# EAGLE design Schematic (EAGLE 6.5.0)
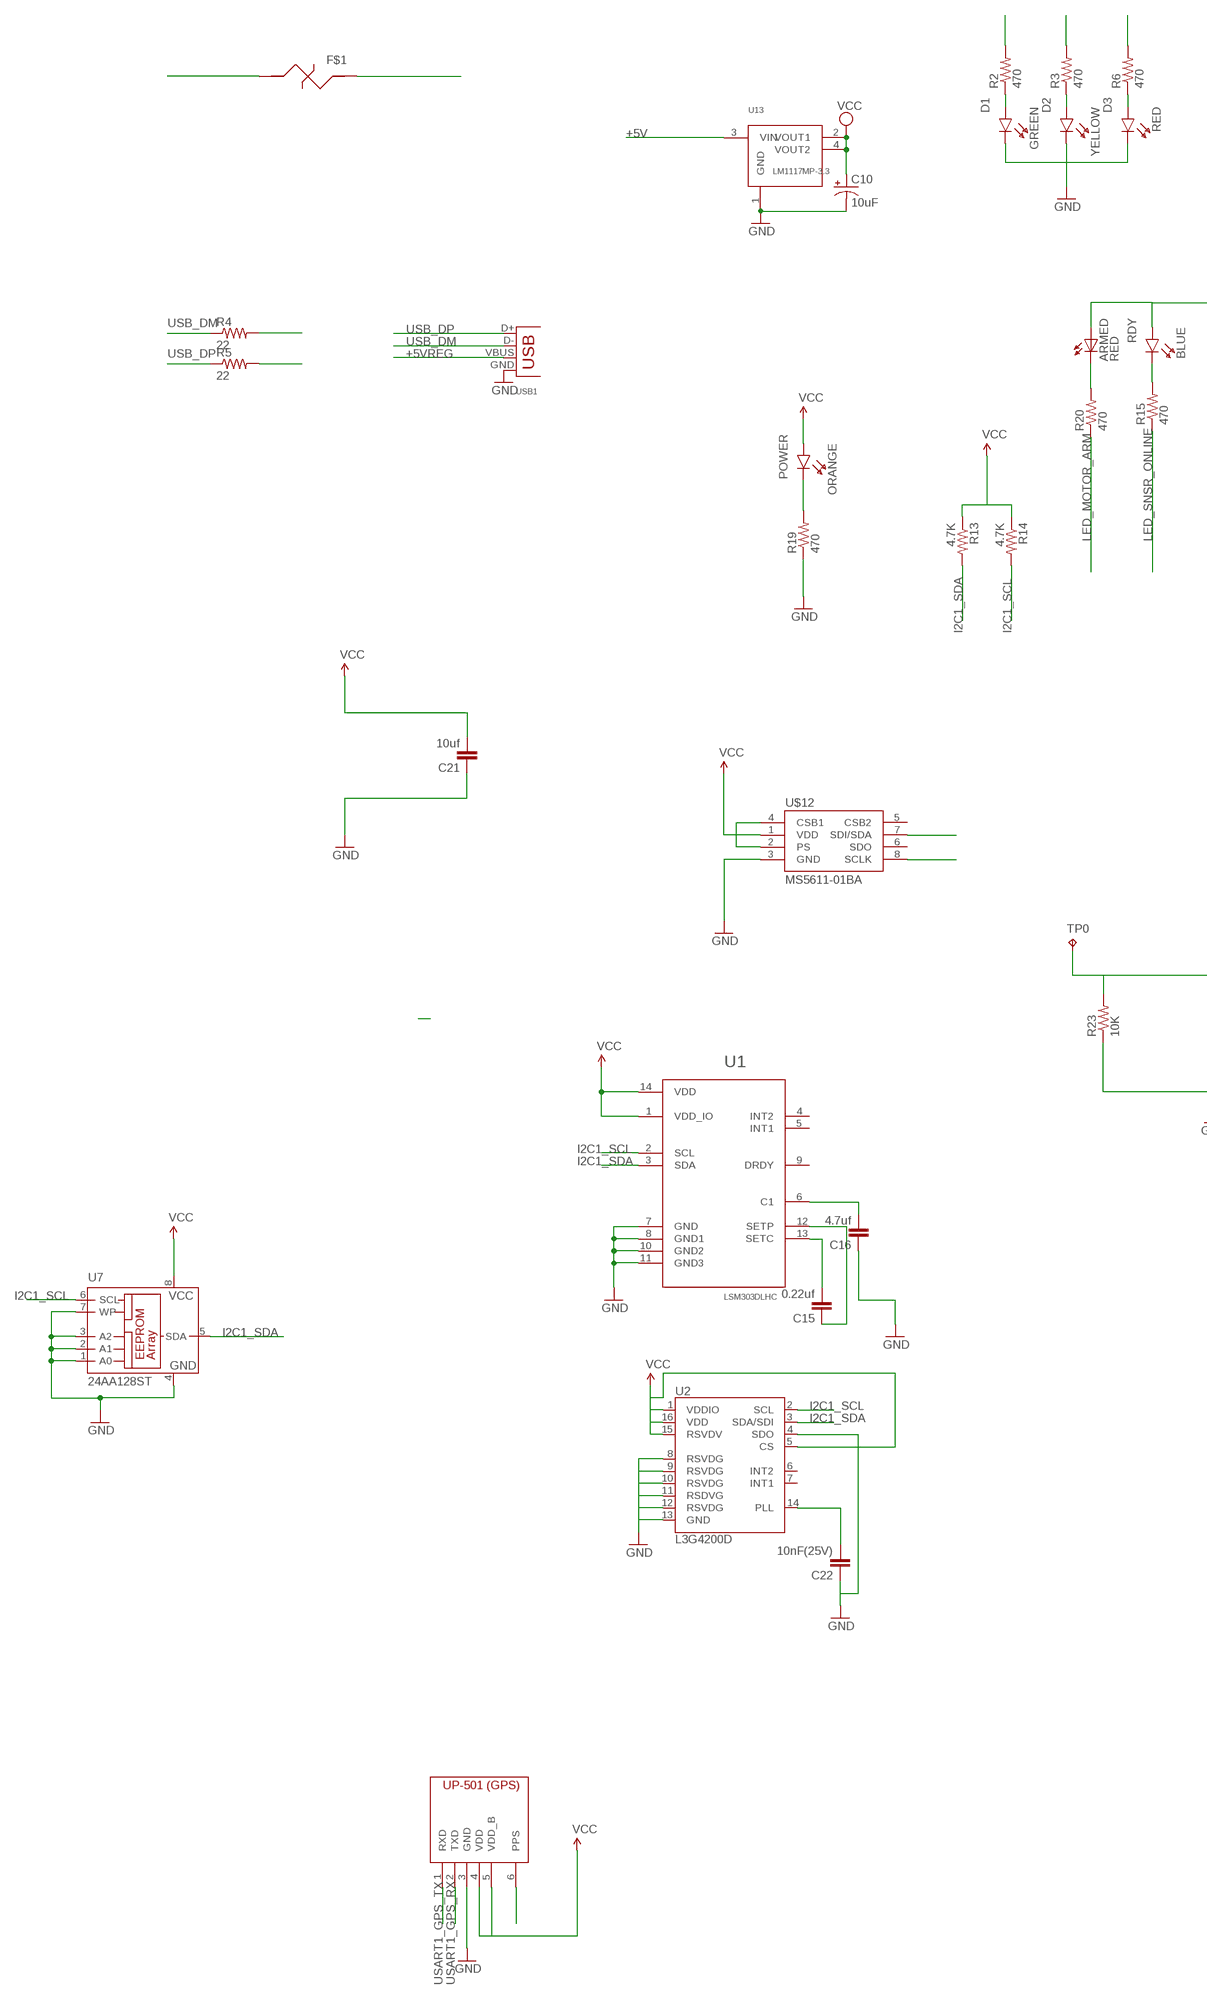
[diagram p0: schematic, sheet 1, part 1 of 2]
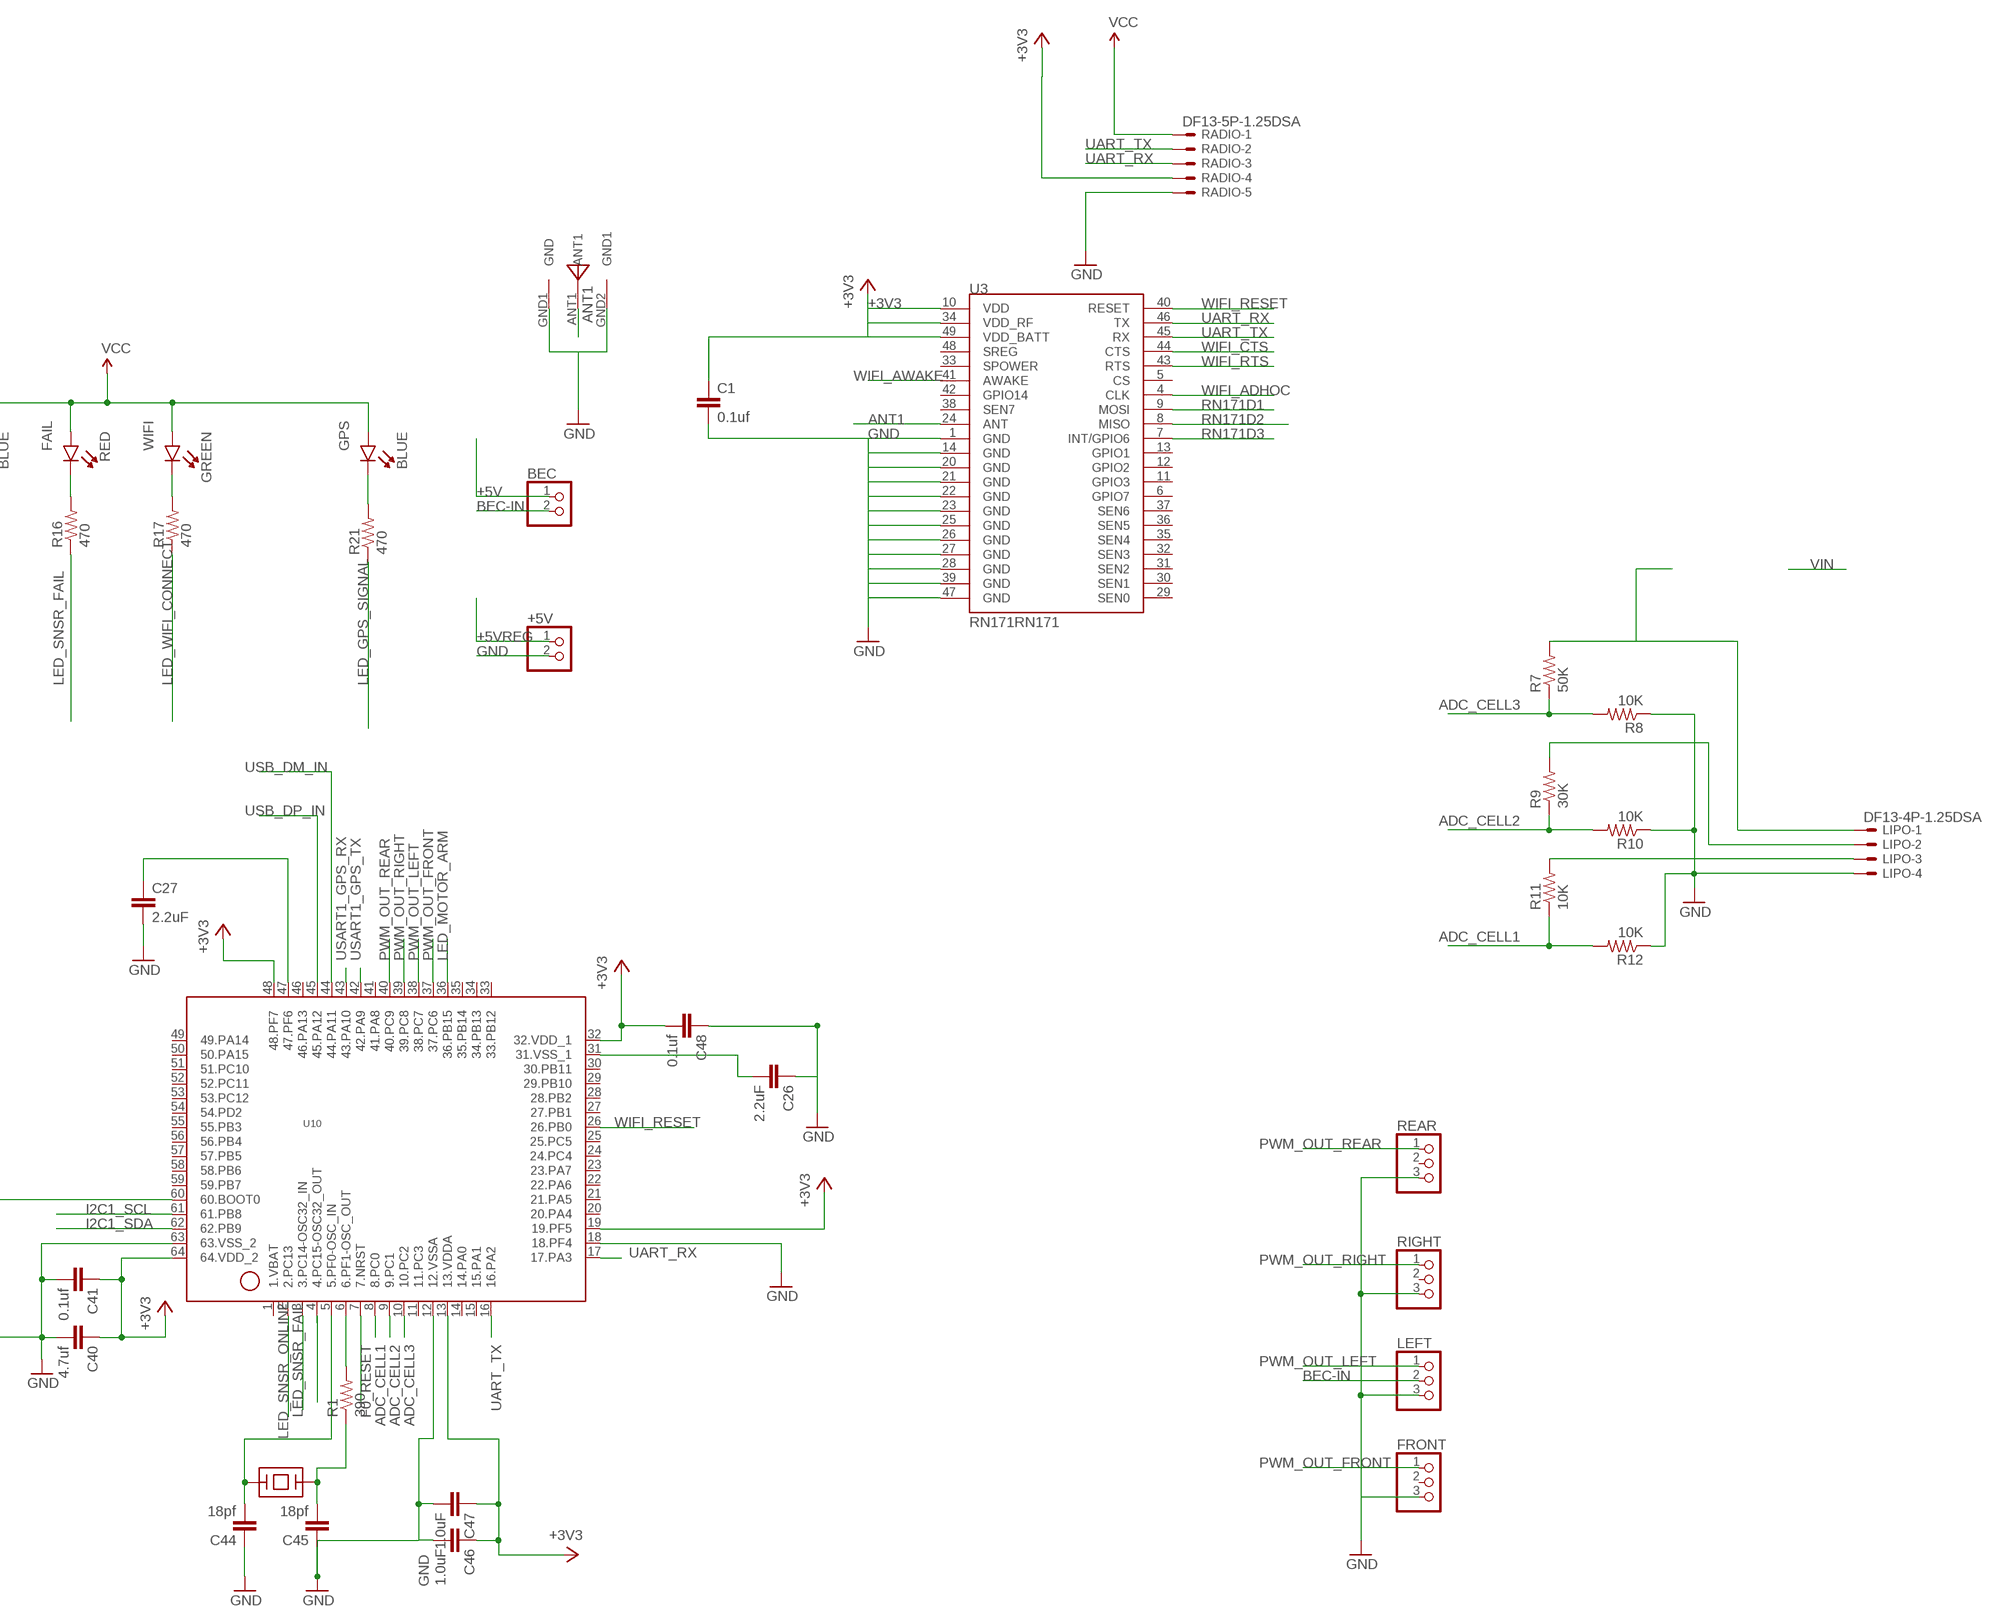
[diagram p1: schematic, sheet 1, part 2 of 2]

## Parts
+5V  PINHD-1X2  [1X02]
ARMED  RED  LED-REDLILYPAD  [LED-1206]
BEC  PINHD-1X2  [1X02]
C1  0.1uf  CAP0805  [0805]
C10  10uF  CPOL-USCT3528  [CT3528]
C15  0.22uf  CAP0805  [0805]
C16  4.7uf  CAP0805  [0805]
C21  10uf  CAP0805  [0805]
C22  10nF(25V)  CAP0805  [0805]
C26  2.2uF  CAP0805  [0805]
C27  2.2uF  CAP0805  [0805]
C40  4.7uf  CAP0805  [0805]
C41  0.1uf  CAP0805  [0805]
C44  18pf  CAP0805  [0805]
C45  18pf  CAP0805  [0805]
C46  1.0uF  CAP0805  [0805]
C47  1.0uF  CAP0805  [0805]
C48  0.1uf  CAP0805  [0805]
D1  GREEN  SMD_LED0805  [LED0805]
D2  YELLOW  SMD_LED0805  [LED0805]
D3  RED  SMD_LED0805  [LED0805]
F1  1206L050_FUSE  [1206L050_FUSE]
FAIL  RED  SMD_LED0805  [LED0805]
FRONT  PINHD-1X3  [1X03]
GPS  BLUE  SMD_LED0805  [LED0805]
LEFT  PINHD-1X3  [1X03]
LIPO  DF13-4P-1.25DSA  [DF13-4P-1.25DSA]
POWER  ORANGE  SMD_LED0805  [LED0805]
R1  390  RESISTOR0805-RES  [0805]
R2  470  RESISTOR0805-RES  [0805]
R3  470  RESISTOR0805-RES  [0805]
R4  22  RESISTOR0805-RES  [0805]
R5  22  RESISTOR0805-RES  [0805]
R6  470  RESISTOR0805-RES  [0805]
R7  50K  RESISTOR0805-RES  [0805]
R8  10K  RESISTOR0805-RES  [0805]
R9  30K  RESISTOR0805-RES  [0805]
R10  10K  RESISTOR0805-RES  [0805]
R11  10K  RESISTOR0805-RES  [0805]
R12  10K  RESISTOR0805-RES  [0805]
R13  4.7K  RESISTOR0805-RES  [0805]
R14  4.7K  RESISTOR0805-RES  [0805]
R15  470  RESISTOR0805-RES  [0805]
R16  470  RESISTOR0805-RES  [0805]
R17  470  RESISTOR0805-RES  [0805]
R19  470  RESISTOR0805-RES  [0805]
R20  470  RESISTOR0805-RES  [0805]
R21  470  RESISTOR0805-RES  [0805]
R23  10K  RESISTOR0805-RES  [0805]
RADIO  DF13-5P-1.25DSA  [DF13-5P-1.25DSA]
RDY  BLUE  SMD_LED0805  [LED0805]
REAR  PINHD-1X3  [1X03]
RIGHT  PINHD-1X3  [1X03]
TP0  TPTP15R  [TP15R]
U1  LSM303DLHC  [LGA3X5X1-14L]
U2  L3G4200D  [LGA16-4X4]
U3  RN171RN171  [RN171]
U7  24AA128ST  [TSSOP8]
U10  STM32F051XXX  [STM32F051XXX_LPFP64]
U13  LM1117MP-3.3  LM1117  [SOT223]
U$1  U.FLCONNECTOR  [U.FLCONNECTOR]
U$4  UP501  [UP-501]
U$12  MS5611-01BA  [MS5611-01BA]
USB1  DX2R005HN2E700  USB-MB-S  [USB-MB-S]
WIFI  GREEN  SMD_LED0805  [LED0805]
X2  ABRACON_ABM7  [ABRACON_ABM7_CERAMIC_XTAL]

## Nets
+3V3: ARMED.A C1.1 C10.+ C21.2 C40.1 C41.1 C46.1 C47.1 C48.2 FAIL.P$1(A) GPS.P$1(A) POWER.P$1(A) R13.1 R14.1 RADIO.4 RDY.P$1(A) U1.1(VDD_IO) U1.14(VDD) U2.1(VDDIO) U2.5(CS) U2.15(RSVDV) U2.16(VDD) U3.10(VDD) U3.34(VDD_RF) U3.49(VDD_BATT) U7.8(VCC) U10.13(13.VDDA) U10.19(19.PF5) U10.32(32.VDD_1) U10.48(48.PF7) U10.64(64.VDD_2) U13.2(VOUT1) U13.4(VOUT2) U$4.4(VDD) U$4.5(VDD_B) U$12.1(VDD) U$12.2(PS) U$12.4(CSB1) WIFI.P$1(A) ; supply symbol labelled VCC
+5V: BEC.1 F1.P$2 RADIO.1 U13.3(VIN) ; supply symbol labelled VCC
+5VREG: +5V.1 F1.P$1 USB1.VBUS
ADC_CELL1: R11.1 R12.2 U10.8(8.PC0)
ADC_CELL2: R9.1 R10.2 U10.9(9.PC1)
ADC_CELL3: R7.1 R8.2 U10.10(10.PC2)
ANT1: U3.24(ANT) U$1.ANT1
BEC-IN: BEC.2 LEFT.2
F0_RESET: U10.7(7.NRST)
GND [power]: +5V.2 C1.2 C10.- C16.1 C21.1 C22.1 C26.1 C27.2 C40.2 C41.2 C44.1 C45.1 C46.2 C47.2 C48.1 D1.C D2.C D3.C FRONT.3 LEFT.3 LIPO.4 R8.1 R10.1 R12.1 R19.1 R23.1 RADIO.5 REAR.3 RIGHT.3 U1.7(GND) U1.8(GND1) U1.10(GND2) U1.11(GND3) U2.4(SDO) U2.8(RSVDG) U2.9(RSVDG) U2.10(RSVDG) U2.11(RSDVG) U2.12(RSVDG) U2.13(GND) U3.1(GND) U3.14(GND) U3.20(GND) U3.21(GND) U3.22(GND) U3.23(GND) U3.25(GND) U3.26(GND) U3.27(GND) U3.28(GND) U3.39(GND) U3.47(GND) U7.1(A0) U7.2(A1) U7.3(A2) U7.4(GND) U7.7(WP) U10.12(12.VSSA) U10.18(18.PF4) U10.63(63.VSS_2) U13.1(GND) U$1.GND1(GND) U$1.GND2(GND1) U$4.3(GND) U$12.3(GND) USB1.GND
I2C1_SCL: R14.2 U1.2(SCL) U2.2(SCL) U7.6(SCL) U10.61(61.PB8) U$12.8(SCLK)
I2C1_SDA: R13.2 U1.3(SDA) U2.3(SDA/SDI) U7.5(SDA) U10.62(62.PB9) U$12.7(SDI/SDA)
LED_GPS_SIGNAL: R21.1 U$4.6(PPS)
LED_MOTOR_ARM: R20.1 U10.36(36.PB15)
LED_SNSR_FAIL: R16.1 U10.3(3.PC14-OSC32_IN)
LED_SNSR_ONLINE: R15.1 U10.2(2.PC13)
LED_WIFI_CONNECT: R17.1 U10.4(4.PC15-OSC32_OUT)
N$1: D1.P$1(A) R2.1
N$4: D2.P$1(A) R3.1
N$5: R1.2 U10.6(6.PF1-OSC_OUT)
N$6: D3.P$1(A) R6.1
N$8: C16.2 U1.6(C1)
N$9: R15.2 RDY.C
N$12: C15.1 U1.12(SETP)
N$13: C15.2 U1.13(SETC)
N$14: FAIL.C R16.2
N$15: ARMED.C R20.2
N$16: LIPO.3 R11.2
N$17: LIPO.2 R9.2
N$19: R17.2 WIFI.C
N$21: POWER.C R19.2
N$25: R23.2 TP0.TP U10.60(60.BOOT0)
N$27: C22.2 U2.14(PLL)
N$30: GPS.C R21.2
N$31: C26.2 U10.31(31.VSS_1)
N$32: C27.1 U10.47(47.PF6)
OSC_IN: C44.2 U10.5(5.PF0-OSC_IN) X2.P$1
OSC_OUT: C45.2 R1.1 X2.P$2
PWM_OUT_FRONT: FRONT.1 U10.37(37.PC6)
PWM_OUT_LEFT: LEFT.1 U10.38(38.PC7)
PWM_OUT_REAR: REAR.1 U10.40(40.PC9)
PWM_OUT_RIGHT: RIGHT.1 U10.39(39.PC8)
RN171D1: R2.2 U3.9(MOSI)
RN171D2: R3.2 U3.8(MISO)
RN171D3: R6.2 U3.7(INT/GPIO6)
UART_RX: RADIO.3 U3.46(TX) U10.17(17.PA3)
UART_TX: RADIO.2 U3.45(RX) U10.16(16.PA2)
USART1_GPS_RX: U10.43(43.PA10) U$4.2(TXD)
USART1_GPS_TX: U10.42(42.PA9) U$4.1(RXD)
USB_DM: R4.1 USB1.D-
USB_DM_IN: R4.2 U10.44(44.PA11)
USB_DP: R5.1 USB1.D+
USB_DP_IN: R5.2 U10.45(45.PA12)
VIN_PROTECTED: LIPO.1 R7.2
WIFI_ADHOC: U3.4(CLK)
WIFI_AWAKE: U3.41(AWAKE)
WIFI_CTS: U3.44(CTS)
WIFI_RESET: U3.40(RESET) U10.26(26.PB0)
WIFI_RTS: U3.43(RTS)
Unconnected: FRONT.2 REAR.2 RIGHT.2 U1.4(INT2) U1.5(INT1) U1.9(DRDY) U2.6(INT2) U2.7(INT1) U3.5(CS) U3.6(GPIO7) U3.11(GPIO3) U3.12(GPIO2) U3.13(GPIO1) U3.29(SEN0) U3.30(SEN1) U3.31(SEN2) U3.32(SEN3) U3.33(SPOWER) U3.35(SEN4) U3.36(SEN5) U3.37(SEN6) U3.38(SEN7) U3.42(GPIO14) U3.48(SREG) U10.1(1.VBAT) U10.11(11.PC3) U10.14(14.PA0) U10.15(15.PA1) U10.20(20.PA4) U10.21(21.PA5) U10.22(22.PA6) U10.23(23.PA7) U10.24(24.PC4) U10.25(25.PC5) U10.27(27.PB1) U10.28(28.PB2) U10.29(29.PB10) U10.30(30.PB11) U10.33(33.PB12) U10.34(34.PB13) U10.35(35.PB14) U10.41(41.PA8) U10.46(46.PA13) U10.49(49.PA14) U10.50(50.PA15) U10.51(51.PC10) U10.52(52.PC11) U10.53(53.PC12) U10.54(54.PD2) U10.55(55.PB3) U10.56(56.PB4) U10.57(57.PB5) U10.58(58.PB6) U10.59(59.PB7) U$12.5(CSB2) U$12.6(SDO)

## Library data of the parts
+5V BEC = pinhead:PINHD-1X2: PIN HEADER
ARMED = SparkFun-LED:LED-RED: Assorted Red LEDs LilyPad 1206- DIO-09912 1206- DIO-00809 0603- DIO-00819; PROD_ID: DIO-09912
C1 C26 C27 C40 C41 C44-C48 = SparkFun-Passives:CAP: Capacitor Standard 0603 ceramic capacitor, and 0.1" leaded capacitor.
C10 = rcl:CPOL-US: POLARIZED CAPACITOR, American symbol
C15 C16 C21 C22 = SparkFun:CAP: Capacitor Standard 0603 ceramic capacitor, and 0.1" leaded capacitor.
D1-D3 FAIL GPS POWER RDY WIFI = SoftwareLogisticsParts:SMD_LED0805
F1 = SoftwareLogisticsParts:1206L050_FUSE
FRONT LEFT REAR RIGHT = pinhead:PINHD-1X3: PIN HEADER
LIPO = pixhawk2:DF13-4P-1.25?
R1-R17 R19-R21 R23 = SparkFun-Passives:RESISTOR: Resistor Basic schematic elements and footprints for 0603, 1206, and PTH resistors.
RADIO = pixhawk2:DF13-5P-1.25?
TP0 = testpad:TP: Test pad
U1 = SoftwareLogisticsParts (2):LSM303DLHC: 3D Accelerometer and 3D Magenetometer Module ST Micro Electronics
U2 = SparkFun:L3G4200D: L3G4200D Three-axis, digital output gyroscope The L3G4200D is a low-power three-axis angular rate sensor, has a full scale of ±250/±500/±2000 dps and is capable of measuring rates with a user-selectable bandwidth. It includes a sensing element and an IC interface capable of providing the measured angular rate to the external world through a digital interface (I2C/SPI). Package: 4x4x1.1 LGA-16 (LGA16-4x4.PAC)
U3 = SparkFun-RF:RN171: WiFi Module
U7 = microchip:24*: Serial EEPROM I2C; MF: MICROCHIP; MPN: 24AA128-I/ST; OC_FARNELL: unknown; OC_NEWARK: 92C6843
U10 = Nwazet.Go:STM32F051XXX
U13 = GHI:LM1117
U$1 = SoftwareLogisticsParts:U.FLCONNECTOR
U$4 = SoftwareLogisticsParts (2):UP501
U$12 = 3DRobotics:MS5611-01BA: MS5611-01BA The MS5611-01BA is a new generation of high resolution altimeter sensors from MEAS Switzerland with SPI and I 2 C bus interface. It is optimized for altimeters and variometers with an altitude resolution of 10 cm. The sensor module includes a high linearity pressure sensor and an ultra low power 24 bit ?? ADC with internal factory calibrated coefficients. It provides a precise digital 24 Bit pressure and temperature value and different operation modes that allow the user to optimize for conversion speed and current consumption. A high resolution temperature output allows the implementation of an altimeter/thermometer function without any additional sensor. The MS5611-01BA can be interfaced to virtually any microcontroller. The communication protocol is simple, without the need of programming internal registers in the device. Small dimensions of only 5.0 mm x 3.0 mm and a height of 1.7 mm allow for integration in mobile devices. This new sensor module generation is based on leading MEMS technology and latest benefits from MEAS Switzerland proven experience and know-how in high volume manufacturing of altimeter modules, which have been widely used for over a decade. The sensing principle employed leads to very low hysteresis and high stability of both pressure and temperature signal. High resolution module, 10 cm Fast conversion down to 1 ms Low power, 1 µA (standby < 0.15 µA) QFN package 5.0 x 3.0 x 1.7 mm3 Supply voltage 1.8 to 3.6 V Integrated digital pressure sensor (24 bit ?? ADC) Operating range: 10 to 1200 mbar, -40 to +85 °C I2C and SPI interface up to 20 MHz No external components (Internal oscillator) Excellent long term stability; DATASHEET: http://www.meas-spec.com/downloads/MS5611-01BA01.pdf; LINK: http://www.meas-spec.com/product/t_product.aspx?id=8503#; MFGPN: MS5611-01BA
USB1 = con-usb-3:USB: USB Connectors
X2 = Nwazet.Go:ABRACON_ABM7

## Net classes
0 default: width 0.178 mm, drill 0.381 mm, clearance 0.178 mm

## Board
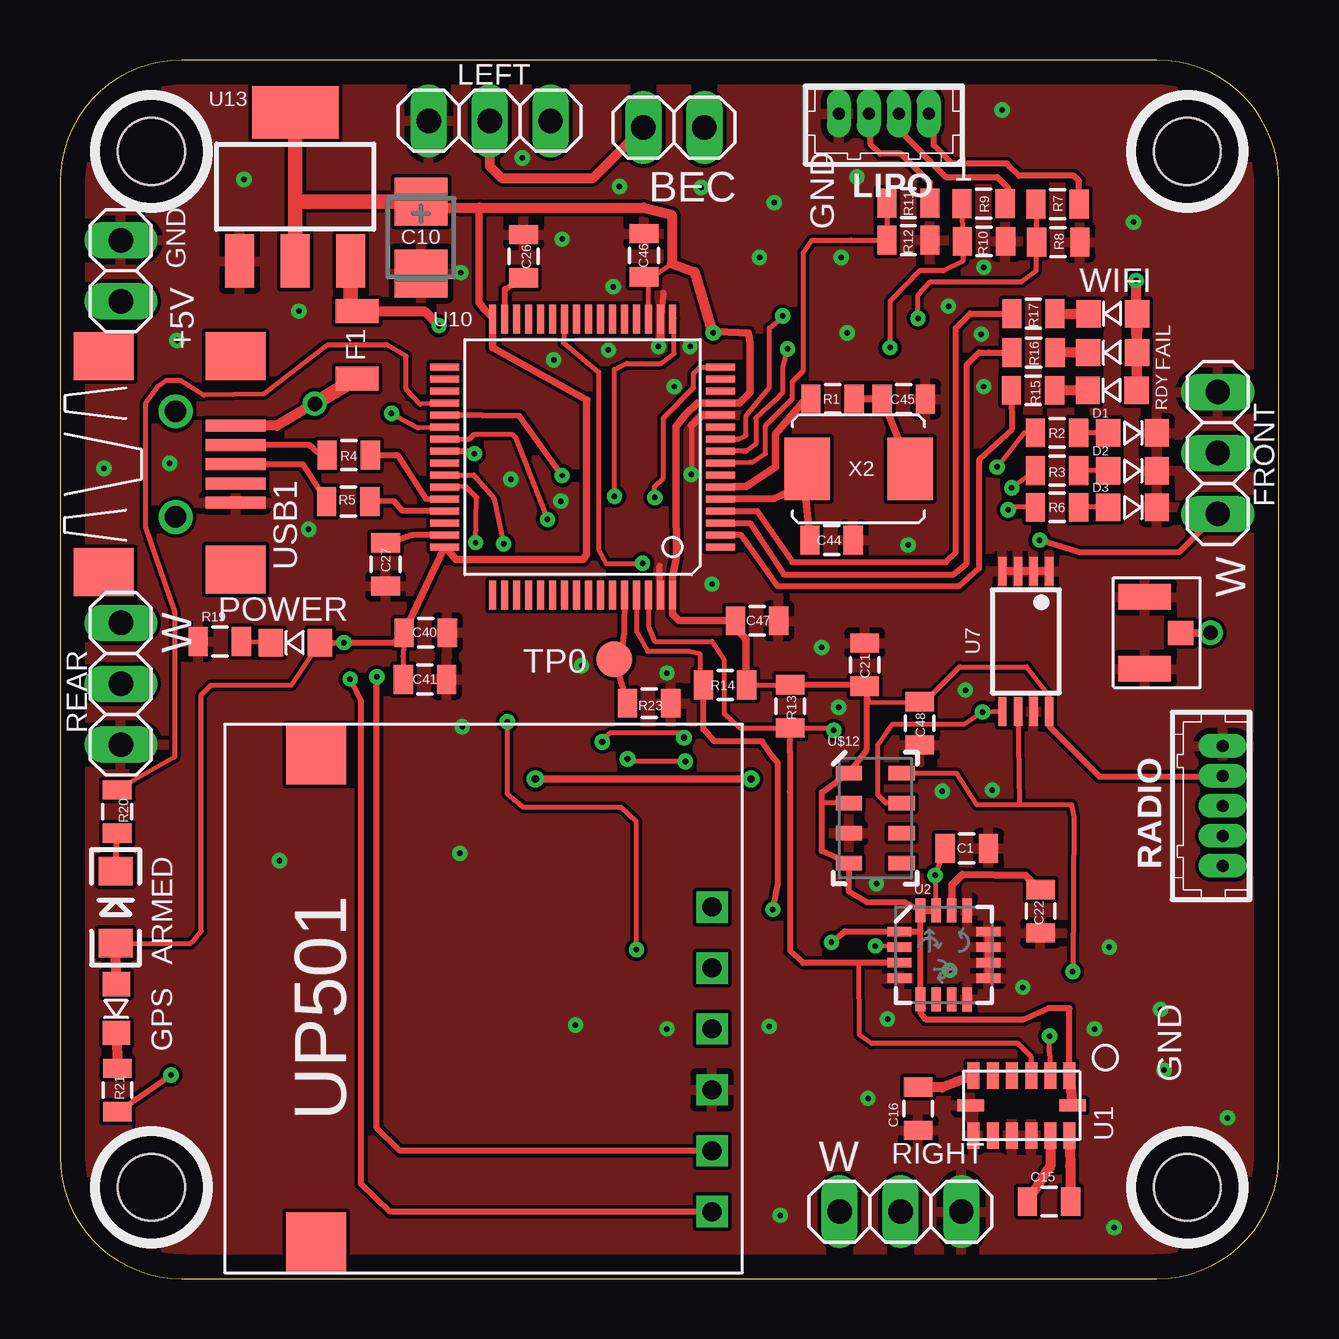
[diagram p2: board, top side]
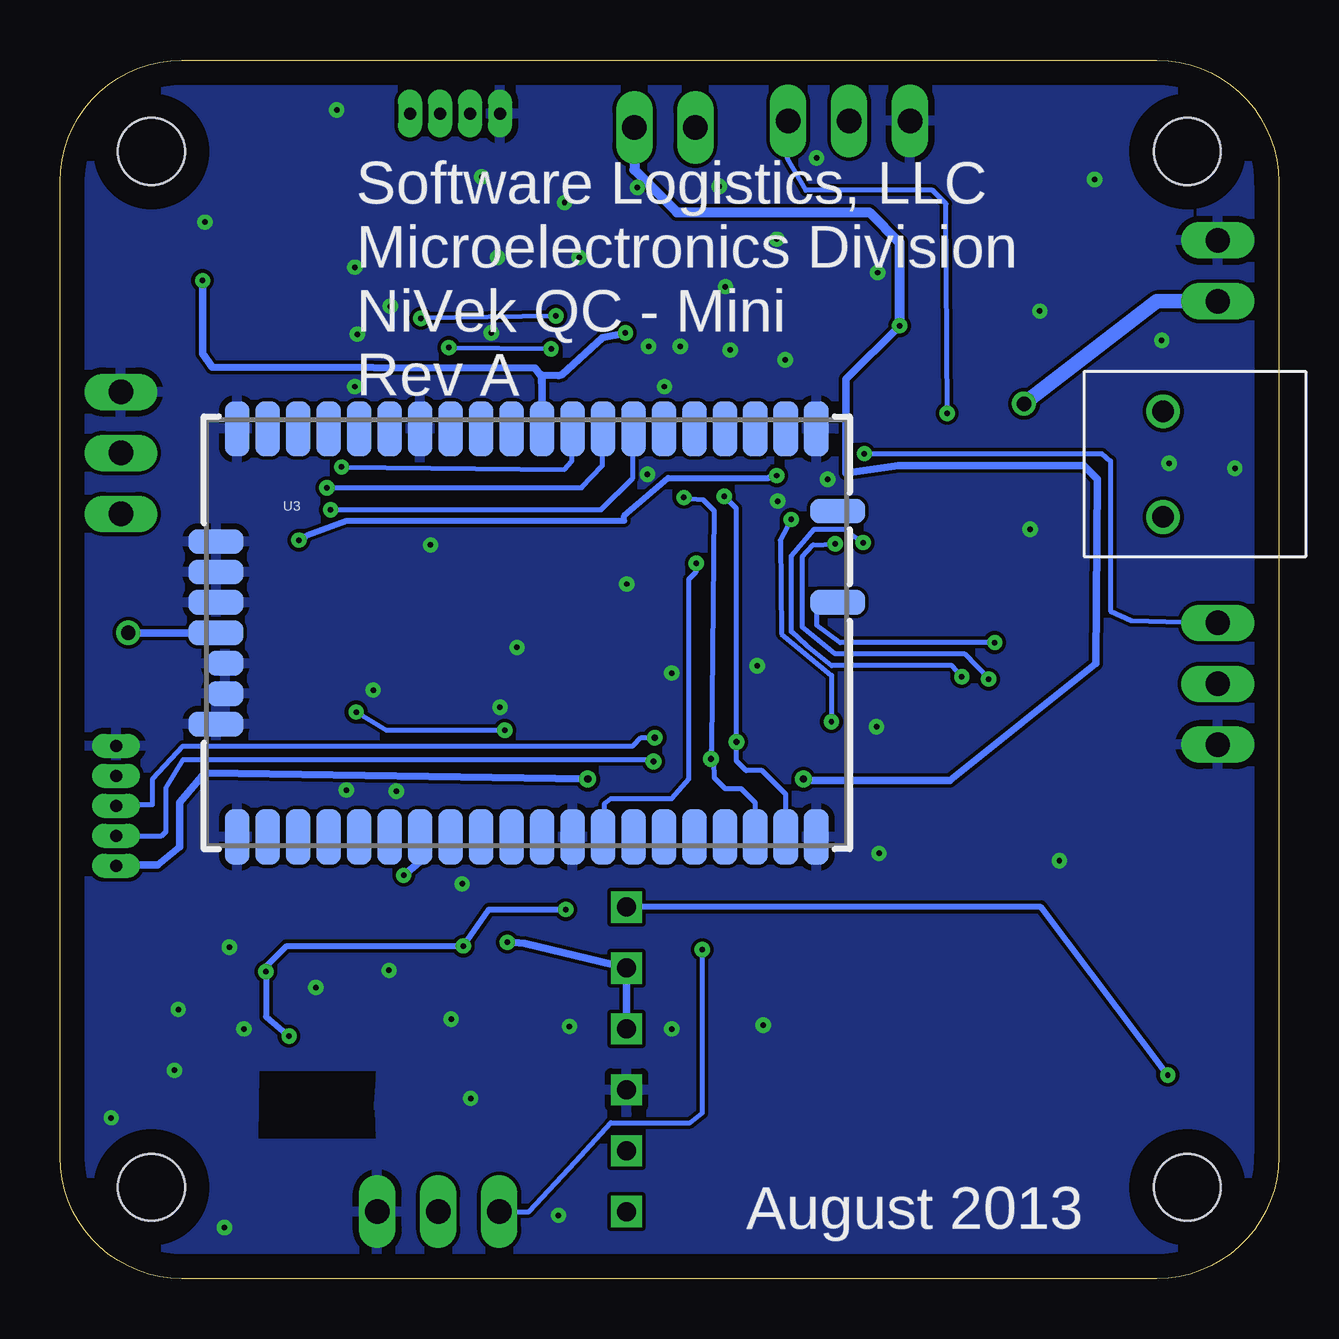
[diagram p3: board, bottom side, seen from below]

Size 50.8 x 50.8 mm. Coordinates in mm from the lower left corner, seen from the top.
Outline: 45.72,50.8 5.08,50.8 arc90 0,45.72 0,5.08 arc90 5.08,0 45.72,0 arc90 50.8,5.08 50.8,45.72 arc90 45.72,50.8
Copper layers (1*16): Top 0.035mm / dielectric 1.5mm / Bottom 0.035mm
Design rules "default *": minimum track width 7mil, minimum drill 8mil, track to track 6mil, track to pad 6mil, pad to pad 6mil, via to via 6mil, smd to smd 6mil, copper to edge 40mil, drill to drill 6mil, minimum pad ring 10mil, minimum via ring 8mil, stop-mask expansion 4mil, vias tented up to drill 10mil, thermal gap 10mil
Holes 2.79 mm at 46.99,46.99 3.81,3.81 3.81,46.99 46.99,3.81

### Footprints (pad centres in the part's own frame; a part is rotated, then mirrored left to right if it is on the bottom)
1X02 = drill 1.016 long: 1 -1.27,0; 2 1.27,0
LED-1206 = smd 1.2 x 1.4: A -1.5,0; C 1.5,0
0805 = smd 0.8 x 1.2: 1 -0.9,0; 2 0.9,0
CT3528 = smd 2 x 2.2: + -1.5,0; - 1.5,0
LED0805 = smd 1.143 x 1.016: C 0,1.016; P$1 0,-1.016
1206L050_FUSE = smd 1 x 1.8: P$1 -1.4,0; P$2 1.4,0
1X03 = drill 1.016 long: 1 -2.54,0; 2 0,0; 3 2.54,0
DF13-4P-1.25DSA = drill 0.5 pad 0.8 long: 1 -1.875,0; 2 -0.625,0; 3 0.625,0; 4 1.875,0
DF13-5P-1.25DSA = drill 0.5 pad 0.8 long: 1 -2.5,0; 2 -1.25,0; 3 0,0; 4 1.25,0; 5 2.5,0
TP15R = smd 1.5 x 1.5: TP 0,0
LGA3X5X1-14L = smd 1.1 x 0.5: 1 -1.25,2; 2 -1.25,1.2; 3 -1.25,0.4; 4 -1.25,-0.4; 5 -1.25,-1.2; 6 -1.25,-2; 8 1.25,-2; 9 1.25,-1.2; 10 1.25,-0.4; 11 1.25,0.4; 12 1.25,1.2; 13 1.25,2 | smd 0.5 x 1.1: 7 0,-2.125; 14 0,2.125
LGA16-4X4 = smd 1 x 0.4: 1 -1.85,0.975; 2 -1.85,0.325; 3 -1.85,-0.325; 4 -1.85,-0.975; 9 1.85,-0.975; 10 1.85,-0.325; 11 1.85,0.325; 12 1.85,0.975 | smd 0.4 x 1: 5 -0.975,-1.85; 6 -0.325,-1.85; 7 0.325,-1.85; 8 0.975,-1.85; 13 0.975,1.85; 14 0.325,1.85; 15 -0.325,1.85; 16 -0.975,1.85
RN171 = smd 1.016 x 2.286: 1 12.065,8.509; 2 10.795,8.509; 3 9.525,8.509; 4 8.255,8.509; 5 6.985,8.509; 6 5.715,8.509; 7 4.445,8.509; 8 3.175,8.509; 9 1.905,8.509; 10 0.635,8.509; 11 -0.635,8.509; 12 -1.905,8.509; 13 -3.175,8.509; 14 -4.445,8.509; 15 -5.715,8.509; 16 -6.985,8.509; 17 -8.255,8.509; 18 -9.525,8.509; 19 -10.795,8.509; 20 -12.065,8.509; 28 -12.065,-8.509; 29 -10.795,-8.509; 30 -9.525,-8.509; 31 -8.255,-8.509; 32 -6.985,-8.509; 33 -5.715,-8.509; 34 -4.445,-8.509; 35 -3.175,-8.509; 36 -1.905,-8.509; 37 -0.635,-8.509; 38 0.635,-8.509; 39 1.905,-8.509; 40 3.175,-8.509; 41 4.445,-8.509; 42 5.715,-8.509; 43 6.985,-8.509; 44 8.255,-8.509; 45 9.525,-8.509; 46 10.795,-8.509; 47 12.065,-8.509 | smd 2.286 x 1.016: 21 -12.954,3.81; 22 -12.954,2.54; 23 -12.954,1.27; 24 -12.954,0; 27 -12.954,-3.81; 48 12.954,5.08; 49 12.954,1.27 | smd 1.524 x 1.016: 25 -12.573,-1.27; 26 -12.573,-2.54
TSSOP8 = smd 0.35 x 1.2: 1 -0.975,-2.925; 2 -0.325,-2.925; 3 0.325,-2.925; 4 0.975,-2.925; 5 0.975,2.925; 6 0.325,2.925; 7 -0.325,2.925; 8 -0.975,2.925
STM32F051XXX_LPFP64 = smd 0.3 x 1.2: 1 -3.75,-5.75; 2 -3.25,-5.75; 3 -2.75,-5.75; 4 -2.25,-5.75; 5 -1.75,-5.75; 6 -1.25,-5.75; 7 -0.75,-5.75; 8 -0.25,-5.75; 9 0.25,-5.75; 10 0.75,-5.75; 11 1.25,-5.75; 12 1.75,-5.75; 13 2.25,-5.75; 14 2.75,-5.75; 15 3.25,-5.75; 16 3.75,-5.75; 33 3.75,5.75; 34 3.25,5.75; 35 2.75,5.75; 36 2.25,5.75; 37 1.75,5.75; 38 1.25,5.75; 39 0.75,5.75; 40 0.25,5.75; 41 -0.25,5.75; 42 -0.75,5.75; 43 -1.25,5.75; 44 -1.75,5.75; 45 -2.25,5.75; 46 -2.75,5.75; 47 -3.25,5.75; 48 -3.75,5.75 | smd 1.2 x 0.3: 17 5.75,-3.75; 18 5.75,-3.25; 19 5.75,-2.75; 20 5.75,-2.25; 21 5.75,-1.75; 22 5.75,-1.25; 23 5.75,-0.75; 24 5.75,-0.25; 25 5.75,0.25; 26 5.75,0.75; 27 5.75,1.25; 28 5.75,1.75; 29 5.75,2.25; 30 5.75,2.75; 31 5.75,3.25; 32 5.75,3.75; 49 -5.75,3.75; 50 -5.75,3.25; 51 -5.75,2.75; 52 -5.75,2.25; 53 -5.75,1.75; 54 -5.75,1.25; 55 -5.75,0.75; 56 -5.75,0.25; 57 -5.75,-0.25; 58 -5.75,-0.75; 59 -5.75,-1.25; 60 -5.75,-1.75; 61 -5.75,-2.25; 62 -5.75,-2.75; 63 -5.75,-3.25; 64 -5.75,-3.75
SOT223 = smd 1.219 x 2.235: 1 -2.311,-3.099; 2 0,-3.099; 3 2.311,-3.099 | smd 3.6 x 2.2: 4 0,3.099
U.FLCONNECTOR = smd 1 x 1.05: ANT1 0,-1.5 | smd 1.05 x 2.2: GND1 -1.5,0; GND2 1.5,0
UP-501 = drill 0.8 square: 1 -8.89,-8.89; 2 -6.35,-8.89; 3 -3.81,-8.89; 4 -1.27,-8.89; 5 1.27,-8.89; 6 3.81,-8.89 | smd 2.5 x 2.5: 7 10.16,7.62; 8 -10.16,7.62
MS5611-01BA = smd 1.1 x 0.6: 1 -1.1,1.875; 2 -1.1,0.625; 3 -1.1,-0.625; 4 -1.1,-1.875; 5 1.1,-1.875; 6 1.1,-0.625; 7 1.1,0.625; 8 1.1,1.875
USB-MB-S = smd 2.5 x 0.5: D+ 2.5,0; D- 2.5,0.8; GND 2.5,-1.6; ID 2.5,-0.8; VBUS 2.5,1.6 | smd 2.5 x 2: P$1 -3,-4.5; P$2 -3,4.5; P$3 2.5,-4.4; P$4 2.5,4.5 | drill 0.9: P$5 0,2.2; P$6 0,-2.2
ABRACON_ABM7_CERAMIC_XTAL = smd 1.9 x 2.6: P$1 -2.15,0; P$2 2.15,0

### Placement (x,y rotation side)
+5V  2.54,42.01 90 top
ARMED  2.32,15.49 90 top
BEC  25.59,47.98 180 top
C1  37.8,17.93 0 top
C10  15.05,43.4 270 top
C15  41.22,3.21 0 top
C16  35.77,7.09 90 top
C21  33.54,25.6 270 top
C22  40.87,15.31 90 top
C26  19.33,42.61 270 top
C27  13.57,29.77 270 top
C40  15.24,26.93 0 top
C41  15.21,24.98 0 top
C44  32.16,30.79 180 top
C45  35.17,36.67 180 top
C46  24.34,42.66 90 top
C47  29.06,27.42 0 top
C48  35.83,23.15 90 top
D1  44.7,35.26 270 top
D2  44.7,33.68 270 top
D3  44.7,32.16 270 top
F1  12.39,38.93 90 top
FAIL  43.88,38.6 90 top
FRONT  48.26,34.42 90 top
GPS  2.35,11.27 180 top
LEFT  17.91,48.26 180 top
LIPO  34.34,48.56 180 top
POWER  9.81,26.51 90 top
R1  32.21,36.68 180 top
R2  41.55,35.26 180 top
R3  41.55,33.68 180 top
R4  12.04,34.33 0 top
R5  12.02,32.4 0 top
R6  41.55,32.16 180 top
R7  41.58,44.79 0 top
R8  41.61,43.2 180 top
R9  38.5,44.81 0 top
R10  38.52,43.24 180 top
R11  35.36,44.83 0 top
R12  35.36,43.29 180 top
R13  30.43,23.86 270 top
R14  27.72,24.74 180 top
R15  40.56,37.03 0 top
R16  40.58,38.6 0 top
R17  40.57,40.22 0 top
R19  6.66,26.56 0 top
R20  2.39,19.47 270 top
R21  2.4,7.86 90 top
R23  24.56,23.99 180 top
RADIO  48.46,19.71 90 top
RDY  43.86,37.03 90 top
REAR  2.54,24.8 270 top
RIGHT  35.04,2.79 0 top
TP0  23.11,25.82 180 top
U1  40.08,7.22 270 top
U2  36.84,13.5 0 top
U3  31.34,26.92 0 bottom
U7  40.26,26.57 180 top
U10  21.78,34.25 90 top
U13  9.8,45.52 0 top
U$1  45.21,26.92 90 top
U$4  18.29,11.68 90 top
U$12  33.99,19.2 0 top
USB1  4.82,33.95 0 top
WIFI  43.89,40.23 90 top
X2  33.29,33.76 0 top

### Tracks (layer width: path | path; a pad name or v marks a point on that pad's centre or on a via)
+3V3  (via drill 0.23)
  Top 0.203: C40.1 14.3,25.95 C41.1 | ARMED.A 4.93,13.97 5.44,13.97 5.59,14.12 5.89,14.48 5.89,24.33 6.3,24.74 9.65,24.74 POWER.P$1 | U10.48 16.08,30.5 | 21.95,36.58 21.96,36.59 21.96,36.62 | R14.1 R13.1 | U2.15 v36.47,16.82 C1.1 | 33.58,24.74 C21.2 | 33.63,24.74 33.67,24.03 C48.2 36.04,24.05 37.49,25.5 40.28,25.5 41.2,24.33 | U10.19 24.53,41.65 25.5,42.32 | U$12.2 31.81,19.83 31.75,19.77
  Top 0.254: 35.87,14.48 U2.5 35.87,11.07 36.07,10.82 40.18,10.82 41.2,11.28 42.06,11.28 42.08,11.26 U1.1 | 35.87,14.48 U2.16 35.2,15.7 33.63,15.7 32.87,16.15 U$12.4 31.75,17.83 31.75,19.77 31.75,20.27 U$12.1 33.63,22.05 33.63,24.74 | 35.87,14.48 U2.1 32.72,14.48 v32.16,14.02 | POWER.P$1 v11.84,26.52 13.93,26.52 C40.1 | 33.58,24.74 33.63,24.74 | 33.63,24.74 R13.1 | 17.7,40.39 U10.32 | 41.2,24.33 41.25,23.62 | 41.25,23.62 U7.8 | 41.25,23.62 41.25,23.01 43.33,20.93 48.43,20.93 RADIO.4
  Top 0.305: U2.16 U2.15 | U10.32 18.03,38.81 21.96,36.62 | U10.48 C40.1 | 16.08,30.5 16.51,29.97 21.79,29.97 21.95,30.18 21.95,36.58 | 17.48,44.65 17.48,40.69 17.7,40.39 | R14.1 28.6,24.77 28.6,26.67 28.16,27.11 C47.1 27.94,27.43 25.81,27.43 25.53,27.71 U10.64 25.53,29.24 25.7,30.07 25.68,32.51 25.68,35.52 26.05,36 26.57,36.51 U10.13 28.32,36.5 28.75,36.93 28.75,39.01 28.7,39.42 27.43,39.47 v27.23,39.42
  Top 0.406: ARMED.A 2.3,13.53 GPS.P$1 | U1.1 U1.14 | WIFI.P$1 FAIL.P$1 RDY.P$1 v44.86,41.6 | v27.23,39.42 26.47,41.96 25.5,42.32 25.5,44.35 24.33,44.65 17.48,44.65 15.29,44.65 15.29,44.66 C10.+ | C46.1 24.43,41.76 24.53,41.65
  Top 0.61: U13.4 9.8,45.06 | 9.8,45.06 U13.2 | C10.+ 9.96,44.9 9.8,45.06
  Bottom 0.203: U3.34 35.79,17.7 35.81,17.37 | v11.84,26.52 18.29,26.52 19.25,27.23 19.25,28.14 U3.49
  Bottom 0.254: 31.9,14.02 v32.16,14.02
  Bottom 0.305: U$4.4 U$4.5 31.45,13.97 31.9,14.02 | 35.81,17.37 v36.47,16.82 | U3.10 30.71,37.01 | 30.71,37.01 30.73,37.59 30.99,37.95 44.45,38 44.86,38.56 v44.86,41.6 | 30.71,37.01 30.71,37.67 30.02,37.64 29.87,37.69 28.19,39.22 v27.23,39.42
+5V  (via drill 0.23, 0.3)
  Top 0.305: v28.8,20.83 v19.81,20.83
  Top 0.406: F1.P$2 15.2,40.33 v15.8,39.73
  Top 0.61: U13.3 12.12,40.6 F1.P$2
  Bottom 0.305: v28.8,20.83 44.7,21.08 44.76,21.08 45.81,19.86 45.81,18 46.73,17.25 48.42,17.25 RADIO.1 | v19.81,20.83 19.46,20.78 13.72,20.78 7.62,25.65 7.57,33.33 8.13,33.88 15.85,33.88 18.03,33.58 18.03,37.49 v15.8,39.73
  Bottom 0.406: BEC.1 26.86,46.22 25.09,44.45 17.06,44.45 15.8,43.19 v15.8,39.73
+5VREG  (via drill 0.6)
  Top 0.203: F1.P$1 11.9,37.24
  Top 0.406: 11.9,37.24 9.04,35.56 USB1.VBUS
  Top 0.61: v10.62,36.47 11.44,36.98 11.9,37.24
  Bottom 0.61: +5V.1 5.08,40.74 v10.62,36.47
ADC_CELL1
  Top 0.203: R11.1 R12.2 32.98,43.29 32.77,43.28 31.34,43.28 30.99,42.77 30.99,37.85 30.53,37.39 30.53,36.68 29.41,35.56 29.41,34.39 28.85,34.04 28.75,34.04 U10.8
ADC_CELL2  (via drill 0.23)
  Top 0.203: R9.1 R10.2 37.64,42.42 36.83,42.01 35.81,42.01 34.59,40.74 v34.59,38.81 | v30.33,38.76 30.12,38 30.12,36.93 29.82,36.63 29.01,35.87 29.01,34.8 28.6,34.49 28.5,34.49 U10.9
  Bottom 0.203: v34.59,38.81 v30.33,38.76
ADC_CELL3  (via drill 0.23)
  Top 0.203: R7.1 R8.2 40.69,43.99 40.69,42.01 40.08,41.55 36.27,41.55 35.76,41 v35.76,40.03 | U10.10 28.25,35 28.3,35 28.6,35.15 28.6,35.97 29.57,37.13 29.57,39.62 30.18,40.13 v30.12,40.13
  Bottom 0.203: v30.12,40.13 v35.76,40.03
ANT1  (via drill 0.6)
  Top 0.305: v47.95,26.92 U$1.ANT1
  Bottom 0.305: U3.24 v47.95,26.92
BEC-IN
  Top 0.406: LEFT.2 17.91,46.38 18.41,45.88 22.21,45.88 BEC.2
GND  (via drill 0.23)
  Top 0.203: 26.31,35.56 v26.31,33.53
  Top 0.254: 25.15,41.1 U10.18 | U10.63 24.99,29.72
  Top 0.305: U7.4 U7.3 U7.2 U7.1 | U2.9 U2.10 U2.11 U2.12 | U10.12 26.75,36 26.31,35.56 | U10.18 25.03,38.95
  Top 0.406: 25.03,38.95 v24.94,38.86
  other vias: 36.78,20.32 48.67,6.71 34.49,10.82 22.86,38.71 35.36,30.58 34.04,16.46 31.75,26.31 27.18,28.96 32.56,42.57 16.71,41.94 20.93,43.33 10.36,31.24 16.76,23.01 32.82,39.42 29.16,42.57 29.77,44.86 23.32,45.53 19.27,46.72 1.83,33.78 4.57,33.99 9.96,40.34 32.46,23.83 23.06,41.35 26.73,45.49 38.51,42.16 20.57,38.3 40.13,12.14 43.74,13.82 21.49,10.57 25.3,10.41 29.57,10.52 18.8,33.32 20.88,32.41 33.68,7.52 45.87,11.23 46.02,8.69 43.94,2.13 30.02,2.64 38.4,39.37 38.51,37.19 37.08,12.85 43.13,10.41 38.86,20.37 37.74,24.54 26.26,38.86 25.3,25.25 25.6,37.19 21.74,25.55 37.03,40.54 44.75,44.04 33.22,45.92 7.67,45.82 4.88,39.12 16.66,17.73 9.14,17.42 39.27,48.72
  pour Top: 0.3,50.57 50.44,50.52 50.53,0.25 0.45,0.39 0.5,4.1
  pour Bottom: 0.19,50.62 50.44,50.62 50.69,-0.06 0.3,0.34 0.4,1.3
I2C1_SCL  (via drill 0.23)
  Top 0.203: U10.61 24.03,26.97 24.49,26.16 26.21,26.16 26.67,26.06 26.67,24.89 26.77,24.79 R14.2 | U2.2 v33.98,13.87 | U1.2 41.28,9.23 41.25,9.5 v41.25,10.11 | U7.6 39.98,19.77 | 39.98,19.77 41.2,19.76 42.16,19.76 42.27,19.25 v42.22,12.8 42.27,12.7 | U$12.8 37.38,21.08 37.38,21.04 38.2,19.76 39.98,19.77
  Top 0.254: v29.72,15.39 29.92,16.46 29.92,21.49 29.72,21.74 29.26,22.4 27.28,22.4 26.82,22.91 R14.2
  Bottom 0.254: v29.72,15.39 32.92,15.39 v33.98,13.87 41.35,13.87 42.27,12.95 v42.22,12.8 42.22,10.92 v41.25,10.11
I2C1_SDA  (via drill 0.23)
  Top 0.203: U1.3 40.49,9.25 39.93,9.8 33.83,9.8 33.33,10.16 33.3,13.16 | U10.62 24.53,27.18 24.79,26.57 27.18,26.57 27.69,25.81 27.69,23.57 28.35,22.96 R13.2 | 30.43,22.45 R13.2 | R13.2 32.15,22.96 32.21,23.01 v32.26,22.86 | U7.5 39.25,23.67 v38.46,23.62 37.69,23.11 34.7,23.11 34.09,22.25 34.09,20.17 34.43,19.83 U$12.7
  Top 0.254: U2.3 33.3,13.16 30.99,13.16 30.43,13.66 30.42,20.32 30.43,21.95 30.43,22.45
  Bottom 0.203: v32.26,22.86 37.19,22.86 v38.46,23.62
LED_GPS_SIGNAL  (via drill 0.23)
  Top 0.254: R21.1 v4.62,8.48
  Bottom 0.254: v4.62,8.48 9.91,15.49 U$4.6
LED_MOTOR_ARM
  Top 0.203: U10.36 15.01,36.45 14.43,37.08 14.43,38.46 13.66,38.91 11.12,38.91 8.48,36.88 5.99,36.83 5.03,37.44 4.42,37.44 4.06,37.19 3.56,36.47 3.56,31.34 4.78,27.79 4.78,21.74 R20.1
LED_SNSR_FAIL
  Top 0.254: U10.3 28.75,31.5 30.18,29.36 37.24,29.36 37.8,29.82 37.8,38.1 38.3,38.61 38.71,38.61 R16.1
LED_SNSR_ONLINE
  Top 0.254: R15.1 39.67,35.4 38.3,34.14 38.3,29.62 37.44,28.85 29.92,28.85 28.4,30.99 U10.2
LED_WIFI_CONNECT
  Top 0.254: U10.4 29.06,32 30.53,29.87 36.93,29.87 37.34,30.28 37.34,39.62 37.95,40.23 39.42,40.23 R17.1
N$1
  Top 0.203: D1.P$1 R2.1
N$4
  Top 0.203: D2.P$1 R3.1
N$5
  Top 0.203: 31.09,36.68 R1.2
  Top 0.254: U10.6 28.09,33.02
  Top 0.305: 28.09,33.02 28.6,33.02 29.82,33.83 29.82,35.2 31.09,36.68
N$6
  Top 0.203: D3.P$1 R6.1
N$7
  cutout Top: 38.56,7.77 41.5,7.77 41.5,6.65 38.56,6.65 38.56,7.06
N$8
  Top 0.406: U1.6 36.78,7.98 C16.2
N$9
  Top 0.406: RDY.C R15.2
N$10
  cutout Bottom: 37.64,8.64 42.47,8.64 42.52,5.84 37.64,5.84 37.69,7.01 37.74,7.01 37.64,8.33
N$12
  Top 0.406: U1.12 41.28,4.65 41.15,4.52 C15.1
N$13
  Top 0.406: U1.13 42.11,4.72 C15.2
N$14
  Top 0.406: FAIL.C R16.2
N$15
  Top 0.254: ARMED.C R20.2
N$16
  Top 0.254: R11.2 36.26,45.68 35.05,46.89 34.19,46.89 33.78,47.3 33.78,49.01 LIPO.3
N$17
  Top 0.254: LIPO.2 34.97,47.89 36.93,45.92 39.06,45.92 39.52,45.47 39.52,44.94 R9.2
N$19
  Top 0.406: R17.2 WIFI.C
N$21
  Top 0.203: POWER.C R19.2
N$25
  Top 0.254: U10.60 23.52,26.92 23.42,26.36 TP0.TP R23.2
N$27
  Top 0.254: 40.84,16.21 C22.2
  Top 0.305: U2.14 37.19,16.41 37.62,16.84 40.23,16.82 40.84,16.21
N$30
  Top 0.406: GPS.C R21.2
N$31
  Top 0.254: U10.31 18.54,41.25 C26.2
N$32
  Top 0.254: U10.47 14.68,30.99 13.92,30.73 C27.1
OSC_IN
  Top 0.254: X2.P$1 31.03,33.09
  Top 0.305: U10.5 29.77,32.51 31.03,33.09 C44.2
OSC_OUT
  Top 0.305: R1.1 C45.2 X2.P$2
PWM_OUT_FRONT  (via drill 0.23)
  Top 0.254: v20.93,33.48 19.15,35.97 U10.37 | FRONT.1 48.24,31.88 46.63,30.28 42.52,30.28 v40.84,30.79
  Bottom 0.254: v20.93,33.48 21.29,33.38 25.45,33.38 27.28,31.8 27.28,31.6 38.86,31.6 40.49,30.99 40.64,30.84 v40.84,30.79
PWM_OUT_LEFT  (via drill 0.23)
  Top 0.203: v13.82,36.07 14.07,35.92 14.94,35.46 U10.38
  Bottom 0.203: v13.82,36.07 13.87,44.81 14.43,45.36 19.71,45.36 20.47,46.69 LEFT.1
PWM_OUT_REAR  (via drill 0.23)
  Top 0.254: U10.40 17.16,34.5 v17.27,34.39
  Bottom 0.203: v17.27,34.39 7.37,34.39 7.01,34.09 7.01,27.84 6.15,27.43 REAR.1
PWM_OUT_RIGHT  (via drill 0.23)
  Top 0.203: v24.03,13.72 24.03,19.05 23.37,19.66 19.3,19.66 18.64,20.22 v18.64,23.22 | U10.39 17.07,35 17.27,35.2 18.85,35.2 19,35.05 v20.32,31.65
  Bottom 0.203: RIGHT.1 31.24,2.79 29.31,4.88 27.84,6.5 24.54,6.5 24.03,6.91 v24.03,13.72 | v20.32,31.65 20.78,30.79 20.73,26.87 18.64,25.15 v18.64,23.22
RN171D1  (via drill 0.23)
  Top 0.203: R2.2 40.18,35.26 v39.06,33.83
  Bottom 0.203: v39.06,33.83 29.77,33.73 29.46,34.09 29.46,35.41 U3.9
RN171D2  (via drill 0.23)
  Top 0.203: R3.2 v39.67,32.97
  Bottom 0.203: v39.67,32.97 29.06,32.97 28.19,33.88 28.19,35.41 U3.8
RN171D3  (via drill 0.23)
  Top 0.203: R6.2 39.62,32.16 v39.52,32.05
  Bottom 0.203: v39.52,32.05 28.25,32.05 26.92,33.38 26.92,35.41 U3.7
UART_RX  (via drill 0.23, 0.25)
  Top 0.203: v23.11,32.61 23.11,37.9 23.62,38.15 25.04,38.15 25.6,38.56 25.6,40.02 U10.17 | v26.01,22.55 26.12,22.52 25.89,22.74 22.92,22.74 22.61,22.43 v22.61,22.37 22.61,22.15
  Bottom 0.203: U3.46 20.55,20.19 21.54,21.18 22.2,21.18 22.61,21.59 v22.61,22.37 22.61,32.11 v23.11,32.61 | RADIO.3 48.46,19.76 46.94,19.76 46.94,20.83 45.67,22.2 26.91,22.21 26.58,22.55 v26.01,22.55
UART_TX  (via drill 0.23, 0.25)
  Top 0.203: v24.79,32.56 24.79,33.02 25.15,33.38 25.15,35.87 26.42,37.13 26.42,37.74 26.67,38 U10.16 | v26.07,21.57 23.63,21.57 v23.66,21.67
  Bottom 0.203: U3.45 21.82,19.84 22.4,20.42 23.06,20.42 23.52,20.88 23.55,21.55 v23.66,21.67 | v23.66,21.67 23.63,22.23 | 23.63,22.23 23.52,32 23.98,32.46 24.84,32.51 v24.79,32.56 | RADIO.2 46.56,18.46 46.38,18.64 46.38,20.47 45.67,21.64 26.16,21.64 v26.07,21.57 | v23.66,21.67 23.63,21.99 23.63,22.23
USART1_GPS_RX  (via drill 0.23)
  Top 0.203: v17.32,30.68 17.37,32.56 16.92,33.02 U10.43
  Top 0.254: U$4.2 14.17,5.33 13.21,6.3 v13.21,25.09
  Bottom 0.203: v13.21,25.09 13.61,25.55 18.64,25.55 19.66,26.36 20.32,26.98 20.32,30.12 19.36,31.24 18.14,31.24 v17.32,30.68
USART1_GPS_TX  (via drill 0.23)
  Top 0.203: U10.42 17.25,33.5 18.09,32.51 v18.49,30.63
  Top 0.254: U$4.1 13.77,2.79 12.55,3.96 12.55,24.08 v12.09,24.99
  Bottom 0.203: v12.09,24.99 13.11,26.06 18.49,26.06 19.86,27.18 19.86,30.07 19.41,30.58 v18.49,30.63
USB_DM
  Top 0.254: R4.1 10.68,34.48 10.46,34.7 10.37,34.75 USB1.D-
USB_DM_IN
  Top 0.254: R4.2 12.94,34.31 13.11,34.34 14.07,34.34 15.24,32.51 15.99,32.46 U10.44
USB_DP
  Top 0.254: USB1.D+ 10.12,33.95 R5.1
USB_DP_IN
  Top 0.254: U10.45 15.04,32 14.28,32 13.92,32.41 R5.2
VIN_PROTECTED
  Top 0.254: R7.2 42.48,45.76 42.27,45.97 39.98,45.97 39.47,46.48 37.19,46.48 36.42,47.24 36.42,48.87 LIPO.1
WIFI_RESET  (via drill 0.23)
  Top 0.203: U10.26 20.98,39.01 22.45,37.8 22.45,30.38 22.76,29.82 v24.28,29.82
  Bottom 0.203: U3.40 28.09,19.81 27.84,20.02 25.3,20.02 24.59,20.83 24.59,29.16 24.28,29.46 v24.28,29.82

### Text on the board
tNames: 1 | GND | GND | W | W | GND | W
bNames: Software Logistics, LLC / Microelectronics Division / NiVek QC - Mini / Rev A | August 2013